# Altium schematic sheet Push_Pull_Drivers.SchDoc: Push Pull Drivers
size B; SheetNumber: 3; SheetTotal: 5
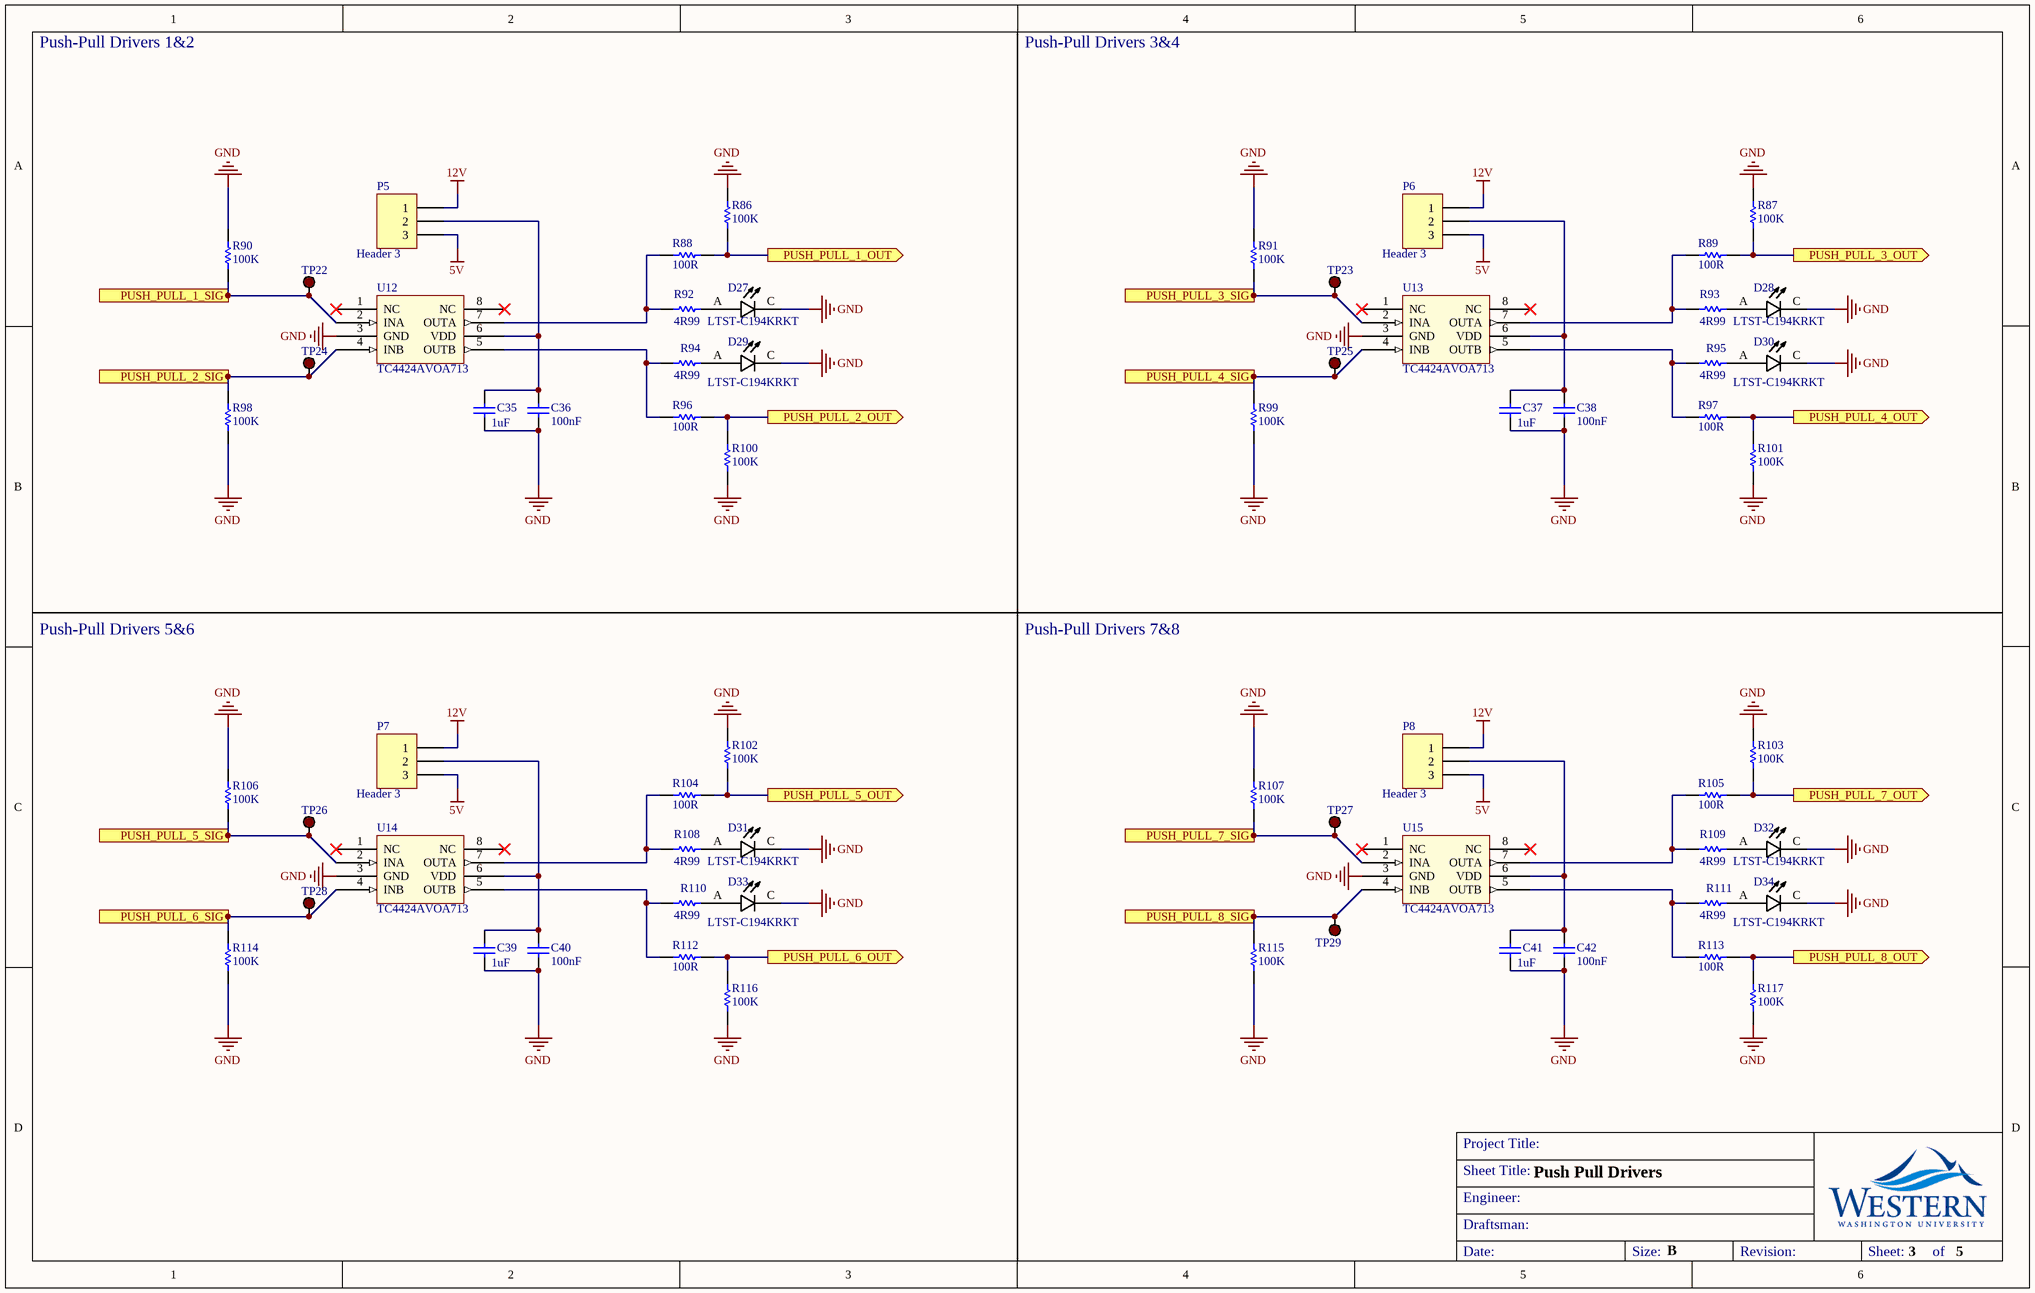
[diagram p0: Push_Pull_Drivers.SchDoc]

## Parts
C35  1uF  [CAPC0603(1608)100_M]
C36  100nF  [CAPC0603(1608)100_M]
C37  1uF  [CAPC0603(1608)100_M]
C38  100nF  [CAPC0603(1608)100_M]
C39  1uF  [CAPC0603(1608)100_M]
C40  100nF  [CAPC0603(1608)100_M]
C41  1uF  [CAPC0603(1608)100_M]
C42  100nF  [CAPC0603(1608)100_M]
D27  LTST-C194KRKT  [LEDC1608X35N_LTST-C194KRKT]
D28  LTST-C194KRKT  [LEDC1608X35N_LTST-C194KRKT]
D29  LTST-C194KRKT  [LEDC1608X35N_LTST-C194KRKT]
D30  LTST-C194KRKT  [LEDC1608X35N_LTST-C194KRKT]
D31  LTST-C194KRKT  [LEDC1608X35N_LTST-C194KRKT]
D32  LTST-C194KRKT  [LEDC1608X35N_LTST-C194KRKT]
D33  LTST-C194KRKT  [LEDC1608X35N_LTST-C194KRKT]
D34  LTST-C194KRKT  [LEDC1608X35N_LTST-C194KRKT]
P5  Header 3  [HDR1X3]
P6  Header 3  [HDR1X3]
P7  Header 3  [HDR1X3]
P8  Header 3  [HDR1X3]
R86  100K  [RESC0603(1608)_M]
R87  100K  [RESC0603(1608)_M]
R88  100R  [RESC1206(3216)_L]
R89  100R  [RESC1206(3216)_L]
R90  100K  [RESC0603(1608)_M]
R91  100K  [RESC0603(1608)_M]
R92  4R99  [RESC0603(1608)_M]
R93  4R99  [RESC0603(1608)_M]
R94  4R99  [RESC0603(1608)_M]
R95  4R99  [RESC0603(1608)_M]
R96  100R  [RESC1206(3216)_L]
R97  100R  [RESC1206(3216)_L]
R98  100K  [RESC0603(1608)_M]
R99  100K  [RESC0603(1608)_M]
R100  100K  [RESC0603(1608)_M]
R101  100K  [RESC0603(1608)_M]
R102  100K  [RESC0603(1608)_M]
R103  100K  [RESC0603(1608)_M]
R104  100R  [RESC1206(3216)_L]
R105  100R  [RESC1206(3216)_L]
R106  100K  [RESC0603(1608)_M]
R107  100K  [RESC0603(1608)_M]
R108  4R99  [RESC0603(1608)_M]
R109  4R99  [RESC0603(1608)_M]
R110  4R99  [RESC0603(1608)_M]
R111  4R99  [RESC0603(1608)_M]
R112  100R  [RESC1206(3216)_L]
R113  100R  [RESC1206(3216)_L]
R114  100K  [RESC0603(1608)_M]
R115  100K  [RESC0603(1608)_M]
R116  100K  [RESC0603(1608)_M]
R117  100K  [RESC0603(1608)_M]
TP22  5001  [Keystone_5001]  (value not drawn)
TP23  5001  [Keystone_5001]  (value not drawn)
TP24  5001  [Keystone_5001]  (value not drawn)
TP25  5001  [Keystone_5001]  (value not drawn)
TP26  5001  [Keystone_5001]  (value not drawn)
TP27  5001  [Keystone_5001]  (value not drawn)
TP28  5001  [Keystone_5001]  (value not drawn)
TP29  5001  [Keystone_5001]  (value not drawn)
U12  TC4424AVOA713  [TC4424AVOA713]
U13  TC4424AVOA713  [TC4424AVOA713]
U14  TC4424AVOA713  [TC4424AVOA713]
U15  TC4424AVOA713  [TC4424AVOA713]

## Ports
PUSH_PULL_1_OUT (out), PUSH_PULL_1_SIG (in), PUSH_PULL_2_OUT (out), PUSH_PULL_2_SIG (in), PUSH_PULL_3_OUT (out), PUSH_PULL_3_SIG (in), PUSH_PULL_4_OUT (out), PUSH_PULL_4_SIG (in), PUSH_PULL_5_OUT (out), PUSH_PULL_5_SIG (in), PUSH_PULL_6_OUT (out), PUSH_PULL_6_SIG (in), PUSH_PULL_7_OUT (out), PUSH_PULL_7_SIG (in), PUSH_PULL_8_OUT (out), PUSH_PULL_8_SIG (in)

## Nets
5V: P5.3 P6.3 P7.3 P8.3
12V: P5.1 P6.1 P7.1 P8.1
GND: C35.1 C36.1 C37.1 C38.1 C39.1 C40.1 C41.1 C42.1 D27.C D28.C D29.C D30.C D31.C D32.C D33.C D34.C R86.2 R87.2 R90.1 R91.1 R98.1 R99.1 R100.1 R101.1 R102.2 R103.2 R106.1 R107.1 R114.1 R115.1 R116.1 R117.1 U12.3(GND) U13.3(GND) U14.3(GND) U15.3(GND)
PUSH_PULL_1_OUT: R86.1 R88.2 ; port PUSH_PULL_1_OUT
PUSH_PULL_1_SIG: R90.2 TP22.1(TP) U12.2(INA) ; port PUSH_PULL_1_SIG
PUSH_PULL_2_OUT: R96.2 R100.2 ; port PUSH_PULL_2_OUT
PUSH_PULL_2_SIG: R98.2 TP24.1(TP) U12.4(INB) ; port PUSH_PULL_2_SIG
PUSH_PULL_3_OUT: R87.1 R89.2 ; port PUSH_PULL_3_OUT
PUSH_PULL_3_SIG: R91.2 TP23.1(TP) U13.2(INA) ; port PUSH_PULL_3_SIG
PUSH_PULL_4_OUT: R97.2 R101.2 ; port PUSH_PULL_4_OUT
PUSH_PULL_4_SIG: R99.2 TP25.1(TP) U13.4(INB) ; port PUSH_PULL_4_SIG
PUSH_PULL_5_OUT: R102.1 R104.2 ; port PUSH_PULL_5_OUT
PUSH_PULL_5_SIG: R106.2 TP26.1(TP) U14.2(INA) ; port PUSH_PULL_5_SIG
PUSH_PULL_6_OUT: R112.2 R116.2 ; port PUSH_PULL_6_OUT
PUSH_PULL_6_SIG: R114.2 TP28.1(TP) U14.4(INB) ; port PUSH_PULL_6_SIG
PUSH_PULL_7_OUT: R103.1 R105.2 ; port PUSH_PULL_7_OUT
PUSH_PULL_7_SIG: R107.2 TP27.1(TP) U15.2(INA) ; port PUSH_PULL_7_SIG
PUSH_PULL_8_OUT: R113.2 R117.2 ; port PUSH_PULL_8_OUT
PUSH_PULL_8_SIG: R115.2 TP29.1(TP) U15.4(INB) ; port PUSH_PULL_8_SIG
NetC35_2: C35.2 C36.2 P5.2 U12.6(VDD)
NetC37_2: C37.2 C38.2 P6.2 U13.6(VDD)
NetC39_2: C39.2 C40.2 P7.2 U14.6(VDD)
NetC41_2: C41.2 C42.2 P8.2 U15.6(VDD)
NetD27_A: D27.A R92.2
NetD28_A: D28.A R93.2
NetD29_A: D29.A R94.2
NetD30_A: D30.A R95.2
NetD31_A: D31.A R108.2
NetD32_A: D32.A R109.2
NetD33_A: D33.A R110.2
NetD34_A: D34.A R111.2
NetR88_1: R88.1 R92.1 U12.7(OUTA)
NetR89_1: R89.1 R93.1 U13.7(OUTA)
NetR94_1: R94.1 R96.1 U12.5(OUTB)
NetR95_1: R95.1 R97.1 U13.5(OUTB)
NetR104_1: R104.1 R108.1 U14.7(OUTA)
NetR105_1: R105.1 R109.1 U15.7(OUTA)
NetR110_1: R110.1 R112.1 U14.5(OUTB)
NetR111_1: R111.1 R113.1 U15.5(OUTB)

Not connected (* = marked no-connect by the designer): U12 1(NC)* 8(NC)*; U13 1(NC)* 8(NC)*; U14 1(NC)* 8(NC)*; U15 1(NC)* 8(NC)*

## Notes on the sheet
- Push-Pull Drivers 1&2
- Push-Pull Drivers 3&4
- Push-Pull Drivers 5&6
- Push-Pull Drivers 7&8
- Sheet Title:
- Project Title:
- Engineer:
- Draftsman:
- Date:
- Size:
- B
- Revision:
- Sheet:        of

## Library data of the parts
C35 C37 C39 C41 = CMP-1035-02745-1: CAP 1uF 50V ±10% 0603 (1608 Metric) Thickness 1mm SMD; Case-EIA: 0603; Case-Metric: 1608; Tolerance: Â±10%; Technology: SMT; Value: 1uF; Rated Voltage: 50 V; Max Thickness: 1 mm
C36 C38 C40 C42 = CMP-1035-02592-1: CAP 100nF 50V ±10% 0603 (1608 Metric) Thickness 1mm SMD; Case-EIA: 0603; Case-Metric: 1608; Tolerance: Â±10%; Technology: SMT; Rated Voltage: 50 V; Max Thickness: 1 mm; Value: 100nF
D27-D34 = LTST-C194KRKT: Red 631nm LED Indication - Discrete 2V 0603 _1608 Metric_; MF: Lite-On Inc.; Digi-Key_Purchase_URL: https://www.digikey.com/product-detail/en/lite-on-inc/LTST-C194KRKT/160-1835-1-ND/2356232?utm_source=snapeda&utm_medium=aggregator&utm_campaign=symbol; MP: LTST-C194KRKT; Package: 0603 Lite-On; SnapEDA_Link: https://www.snapeda.com/parts/LTST-C194KRKT/Lite-On%20Inc./view-part/370565/?ref=snap; Digi-Key_Part_Number: 160-1835-1-ND; Value: *
P5-P8 = Header 3: Header, 3-Pin; LatestRevisionDate: 17-Jul-2002; LatestRevisionNote: Re-released for DXP Platform.; Publisher: Altium Limited
R86 R87 R90 R91 R98-R103 R106 R107 R114-R117 = CMP-1012-00736-1: 100K 0.1W 1% 0603 (1608 Metric)  SMD; Value: 100000.00 Ohm; Case-Metric: 1608; Case-EIA: 0603; Power: 0.1 W; Tolerance: 1 %; Technology: SMT
R88 R89 R96 R97 R104 R105 R112 R113 = CMP-1014-00397-1: 100R 0.25W 1% 1206 (3216 Metric)  SMD; Value: 100.00 Ohm; Case-Metric: 3216; Case-EIA: 1206; Technology: SMT; Tolerance: 1 %; Power: 0.25 W
R92-R95 R108-R111 = CMP-1012-00250-1: 4R99 0.1W 1% 0603 (1608 Metric)  SMD; Value: 4.99 Ohm; Case-Metric: 1608; Case-EIA: 0603; Technology: SMT; Tolerance: 1 %; Power: 0.1 W
TP22-TP29 = TEST POINT: TEST POINT PC MINI .040"D BLACK; Manufacturer: Keystone Electronics; Supplier 1: Digi-Key; Manufacturer Part Number: 5001; RoHS: RoHS Compliant; Category: Test and Measurement; Stock 1: 7538; Pricing 1: 1=0.34, 10=0.315, 50=0.2296, 100=0.2206, 250=0.19812, 500=0.1891, 1000=0.15759, 2500=0.14408, 5000=0.13508 (USD); Packaging: Bulk; Type: PC Test Point, Miniature; Terminal: 0.010" x 0.020" (0.25mm x 0.51mm) Phosphor Bronze Wire, Silver Plated; Mounting Type: 0.040" (1.02mm) Hole Diameter; Material: Base, Nylon 46, UL 94V-0; Color: Black; ComponentLink1URL: http://www.keyelco.com/product-pdf.cfm?p=1310; ComponentLink1Description: http://www.keyelco.com/product-pdf.cfm?p=1310; Supplier Part Number 1: 5001K-ND